# Altium schematic sheet Mixing.SchDoc
size A4; SheetNumber: 4; SheetTotal: 4
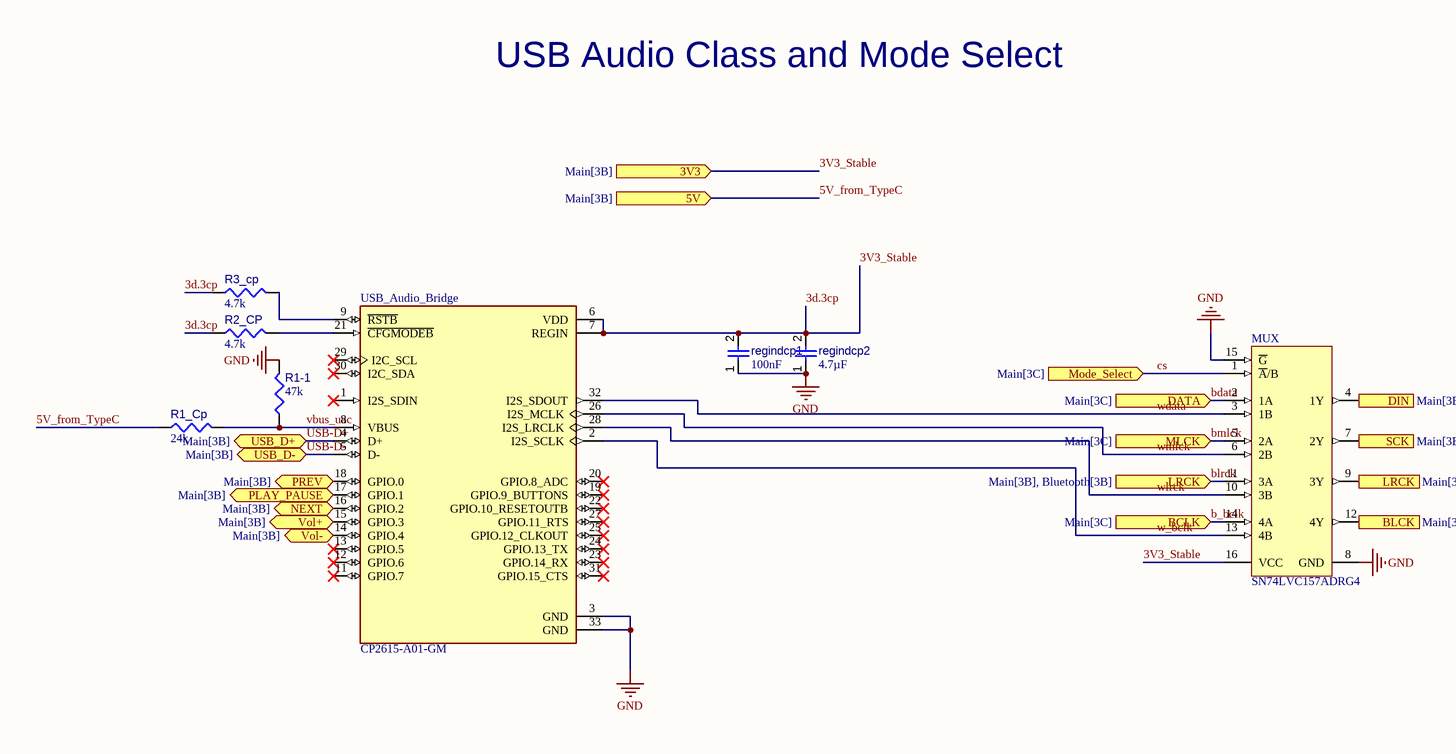
[diagram p0: Mixing.SchDoc, left]

## Parts
MUX  SN74LVC157ADRG4  [D0016A_N]
R1-1  value 47k  [RESC0402(1005)_L]  (hidden comment: 4D7KR2F)
R1_Cp  value 24k  [RESC0402(1005)_L]  (hidden comment: 4D7KR2F)
R2_CP  value 4.7k  [RESC0402(1005)_L]  (hidden comment: 4D7KR2F)
R3_cp  value 4.7k  [RESC0402(1005)_L]  (hidden comment: 4D7KR2F)
regindcp1  value 100nF  [CAPC0402(1005)60_L]  (hidden comment: Capacitor 100nF +/-20% 50V 0402)
regindcp2  value 4.7µF  [CAPC0805(2012)145_L]  (hidden comment: Capacitor 4.7µF +/-40% 25V 0805)
USB_Audio_Bridge  CP2615-A01-GM  [QFN50P500X500X90-33N]

## Ports
3V3 (in, see Main[3B]), 5V (in, see Main[3B]), BCLK (in, see Main[3C]), BLCK (out, see Main[3B], Bluetooth[3B]), DATA (in, see Main[3C]), DIN (out, see Main[3B], Bluetooth[3B]), LRCK (in, see Main[3B], Bluetooth[3B]), LRCK (out, see Main[3B], Bluetooth[3B]), MLCK (in, see Main[3C]), Mode_Select (in, see Main[3C]), NEXT (bidir, see Main[3B]), PLAY_PAUSE (bidir, see Main[3B]), PREV (bidir, see Main[3B]), SCK (out, see Main[3B], Bluetooth[3B]), USB_D+ (bidir, see Main[3B]), USB_D- (bidir, see Main[3B]), Vol+ (bidir, see Main[3B]), Vol- (bidir, see Main[3B])

## Nets
GND: MUX.8(GND) MUX.15(~{G}) R1-1.2 regindcp1.1 regindcp2.1 USB_Audio_Bridge.3(GND) USB_Audio_Bridge.33(GND)
3d.3cp: MUX.16(VCC) R2_CP.1 R3_cp.1 regindcp1.2 regindcp2.2 USB_Audio_Bridge.6(VDD) USB_Audio_Bridge.7(REGIN) ; port 3V3  [also labelled 3V3_Stable]
5V_from_TypeC: R1_Cp.1 ; port 5V
b_bclk: MUX.14(4A) ; port BCLK
bdata: MUX.2(1A) ; port DATA
BLCK: MUX.12(4Y) ; port BLCK
blrck: MUX.9(3Y) MUX.11(3A) ; port LRCK
bmlck: MUX.5(2A) ; port MLCK
cs: MUX.1(~{A}/B) ; port Mode_Select
DIN: MUX.4(1Y) ; port DIN
NEXT: USB_Audio_Bridge.16(GPIO.2) ; port NEXT
PLAY_PAUSE: USB_Audio_Bridge.17(GPIO.1) ; port PLAY_PAUSE
PREV: USB_Audio_Bridge.18(GPIO.0) ; port PREV
SCK: MUX.7(2Y) ; port SCK
USB-D+: USB_Audio_Bridge.4(D+) ; port USB_D+
USB-D-: USB_Audio_Bridge.5(D-) ; port USB_D-
vbus_uac: R1-1.1 R1_Cp.2 USB_Audio_Bridge.8(VBUS)
Vol+: USB_Audio_Bridge.15(GPIO.3) ; port Vol+
Vol-: USB_Audio_Bridge.14(GPIO.4) ; port Vol-
w_bclk: MUX.13(4B) USB_Audio_Bridge.2(I2S_SCLK)
wdata: MUX.3(1B) USB_Audio_Bridge.32(I2S_SDOUT)
wlrck: MUX.10(3B) USB_Audio_Bridge.28(I2S_LRCLK)
wmlck: MUX.6(2B) USB_Audio_Bridge.26(I2S_MCLK)
NetR2_CP_2: R2_CP.2 USB_Audio_Bridge.21(~{CFGMODEB})
NetR3_cp_2: R3_cp.2 USB_Audio_Bridge.9(~{RSTB})

Not connected (* = marked no-connect by the designer): USB_Audio_Bridge 1(I2S_SDIN)* 11(GPIO.7)* 12(GPIO.6)* 13(GPIO.5)* 19(GPIO.9_BUTTONS)* 20(GPIO.8_ADC)* 22(GPIO.10_RESETOUTB)* 23(GPIO.14_RX)* 24(GPIO.13_TX)* 25(GPIO.12_CLKOUT)* 27(GPIO.11_RTS)* 29(I2C_SCL)* 30(I2C_SDA)* 31(GPIO.15_CTS)*

## Notes on the sheet
- USB Audio Class and Mode Select

## Library data of the parts
MUX = CMP-1633-00171-2: Quadruple 2-Line To1-Line Data Selector / Multiplexer, D0016A, LARGE T&R; Manufacturer: Texas Instruments; F @ Nom Voltage(Max)(Mhz): 100; Technology Family: LVC; Bits(#): 2; tpd @ Nom Voltage(Max)(ns): 13.5,7.4,5.7,5; Input Type: TLL/CMOS; ICC @ Nom Voltage(Max)(mA): 0.04; Output Drive (IOL/IOH)(Max)(mA): 24/-24; Channels(#): 4; VCC(Max)(V): 3.6; VCC(Min)(V): 1.65; Function: Encoder/Multiplexer; Voltage(Nom)(V): 1.8,2.5,2.7,3.3; Configuration: 2：1; Schmitt Trigger: No; Rating: Catalog; Output Type: CMOS; Generic Part Number: SN74LVC157A; Operating Temperature Range(C): -40 to 85; Code_JEDEC: MS-012 variation AC; PackageReference: D0016A; Type: Standard; DatasheetVersion: SCAS292Q
R1-1 R1_Cp R2_CP R3_cp = CMP-009-00105-2: 4K7 0.063W 1% 0402 (1005 Metric)  SMD; Power: 63mW; Mounting Technology: SMT; Case/Package: 0402; Tolerance: 1%; Pins: 2
regindcp1 = CMP-001-00067-3: Chip Capacitor, 100nF +/-20%, 50V, 0402, Thickness 0.6 mm; Tolerance: 10%; Min Operating Temperature: -55°C; Pins: 2; Case/Package: 0402; Max Operating Temperature: 85°C; Voltage Rating: 50V; Mounting Technology: SMT
regindcp2 = CMP-001-00080-4: Chip Capacitor, 4.7µF +/-40%, 25V, 0805, Thickness 1.45 mm; Tolerance: 20%; Voltage Rating: 25V; Min Operating Temperature: -55°C; Max Operating Temperature: 85°C; Pins: 2; Mounting Technology: SMT; Case/Package: 0805
USB_Audio_Bridge = CMP-025-000000-1: USB Bridge, USB to I2S USB 1.0 I2S Interface 32-QFN (5x5); MF: Silicon Labs; SnapEDA_Link: https://www.snapeda.com/parts/CP2615-A01-GM/Silicon+Labs/view-part/?ref=snap; Value: *; Package: QFN-32 Silicon Labs; Design Item ID: CP2615-A01-GM; MP: CP2615-A01-GM; Check_prices: https://www.snapeda.com/parts/CP2615-A01-GM/Silicon+Labs/view-part/?ref=eda; Pin Count: 32; Component Type: Standard; Source: CP2615-A01-GM.SchLib